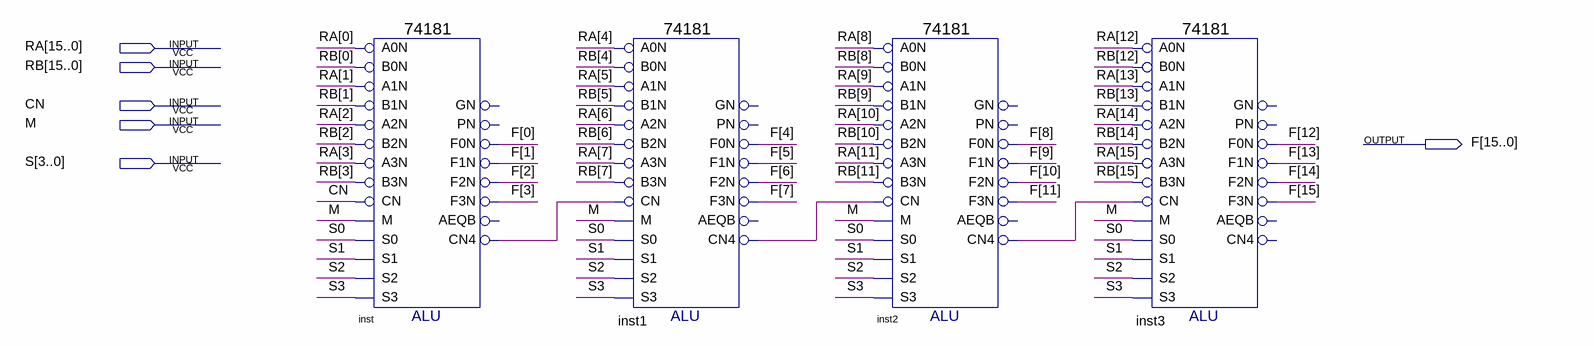
[diagram p0: schematic sheet]
// Quartus schematic ALU_unit.bdf as structural Verilog: 4 symbols, 6 pins
module ALU_unit (
  input  [15:0] RA,
  input  [15:0] RB,
  input  CN,
  input  M,
  input  [3:0] S,
  output [15:0] F
);

  wire inst1_cn4, inst2_cn4, inst_cn4;

  \74181  inst (
    .B0N(RB[0]), .A0N(RA[0]), .A1N(RA[1]), .B1N(RB[1]), .A3N(RA[3]), .B2N(RB[2]), .A2N(RA[2]), .M(M),
    .CN(CN), .B3N(RB[3]), .S2(S[2]), .S1(S[1]), .S0(S[0]), .S3(S[3]), .F3N(F[3]), .F1N(F[1]), .F0N(F[0]),
    .CN4(inst_cn4), .F2N(F[2]));  // open: PN, GN, AEQB
  \74181  inst1 (
    .B0N(RB[4]), .A0N(RA[4]), .A1N(RA[5]), .B1N(RB[5]), .A3N(RA[7]), .B2N(RB[6]), .A2N(RA[6]), .M(M),
    .CN(inst_cn4), .B3N(RB[7]), .S2(S[2]), .S1(S[1]), .S0(S[0]), .S3(S[3]), .F3N(F[7]), .F1N(F[5]),
    .F0N(F[4]), .CN4(inst1_cn4), .F2N(F[6]));  // open: PN, GN, AEQB
  \74181  inst2 (
    .B0N(RB[8]), .A0N(RA[8]), .A1N(RA[9]), .B1N(RB[9]), .A3N(RA[11]), .B2N(RB[10]), .A2N(RA[10]), .M(M),
    .CN(inst1_cn4), .B3N(RB[11]), .S2(S[2]), .S1(S[1]), .S0(S[0]), .S3(S[3]), .F3N(F[11]), .F1N(F[9]),
    .F0N(F[8]), .CN4(inst2_cn4), .F2N(F[10]));  // open: PN, GN, AEQB
  \74181  inst3 (
    .B0N(RB[12]), .A0N(RA[12]), .A1N(RA[13]), .B1N(RB[13]), .A3N(RA[15]), .B2N(RB[14]), .A2N(RA[14]), .M(M),
    .CN(inst2_cn4), .B3N(RB[15]), .S2(S[2]), .S1(S[1]), .S0(S[0]), .S3(S[3]), .F3N(F[15]), .F1N(F[13]),
    .F0N(F[12]), .F2N(F[14]));  // open: PN, GN, AEQB, CN4
endmodule
